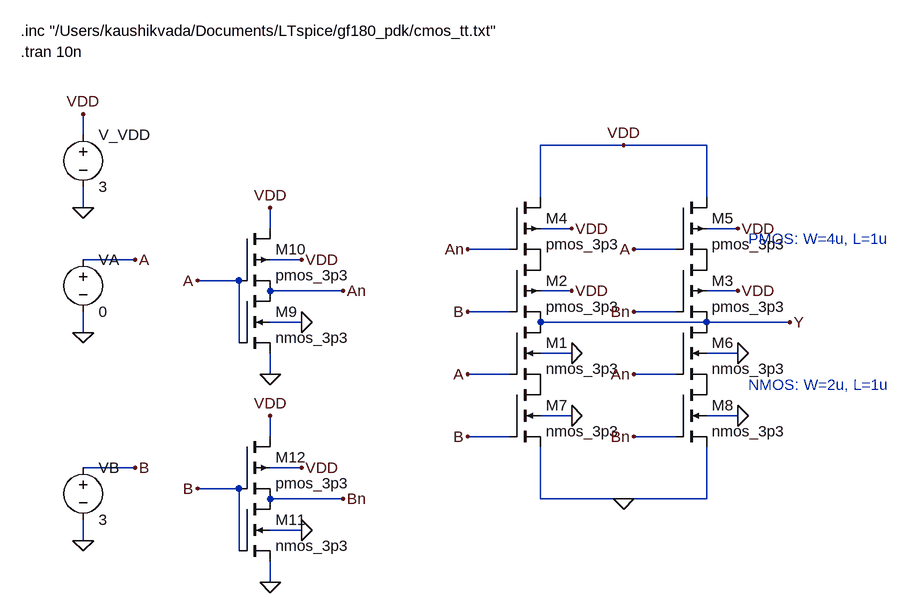
[diagram p0: schematic Q2_2_copy.asc]
Q2_2_copy.asc, the LTspice schematic file:
Version 4
SHEET 1 1600 900
WIRE 112 112 112 80
WIRE 944 128 816 128
WIRE 1072 128 944 128
WIRE 816 208 816 128
WIRE 1072 208 1072 128
WIRE 112 224 112 192
WIRE 400 256 400 224
WIRE 864 256 816 256
WIRE 1120 256 1072 256
WIRE 768 288 704 288
WIRE 1024 288 960 288
WIRE 192 304 112 304
WIRE 448 304 400 304
WIRE 352 336 288 336
WIRE 512 352 400 352
WIRE 864 352 816 352
WIRE 1120 352 1072 352
WIRE 768 384 704 384
WIRE 1024 384 960 384
WIRE 448 400 400 400
WIRE 1072 400 816 400
WIRE 1200 400 1072 400
WIRE 112 416 112 384
WIRE 352 432 352 336
WIRE 864 448 816 448
WIRE 1120 448 1072 448
WIRE 400 480 400 448
WIRE 768 480 704 480
WIRE 1024 480 960 480
WIRE 864 544 816 544
WIRE 1120 544 1072 544
WIRE 400 576 400 544
WIRE 768 576 704 576
WIRE 1024 576 960 576
WIRE 192 624 112 624
WIRE 448 624 400 624
WIRE 352 656 288 656
WIRE 512 672 400 672
WIRE 816 672 816 592
WIRE 944 672 816 672
WIRE 1072 672 1072 592
WIRE 1072 672 944 672
WIRE 448 720 400 720
WIRE 112 736 112 704
WIRE 352 752 352 656
WIRE 400 800 400 768
FLAG 112 80 VDD
FLAG 112 224 0
FLAG 192 304 A
FLAG 112 416 0
FLAG 192 624 B
FLAG 112 736 0
FLAG 400 224 VDD
FLAG 400 480 0
FLAG 288 336 A
FLAG 512 352 An
FLAG 448 304 VDD
FLAG 448 400 0
FLAG 400 544 VDD
FLAG 400 800 0
FLAG 288 656 B
FLAG 512 672 Bn
FLAG 448 624 VDD
FLAG 448 720 0
FLAG 944 128 VDD
FLAG 944 672 0
FLAG 1200 400 Y
FLAG 704 288 An
FLAG 960 288 A
FLAG 704 384 B
FLAG 960 384 Bn
FLAG 704 480 A
FLAG 960 480 An
FLAG 704 576 B
FLAG 960 576 Bn
FLAG 864 256 VDD
FLAG 1120 256 VDD
FLAG 864 352 VDD
FLAG 1120 352 VDD
FLAG 864 448 0
FLAG 1120 448 0
FLAG 864 544 0
FLAG 1120 544 0
SYMBOL voltage 112 96 R0
SYMATTR InstName V_VDD
SYMATTR Value 3
SYMBOL voltage 112 288 R0
SYMATTR InstName VA
SYMATTR Value 0
SYMBOL voltage 112 608 R0
SYMATTR InstName VB
SYMATTR Value 3
SYMBOL pmos4 352 256 R0
SYMATTR InstName M10
SYMATTR Value pmos_3p3
SYMBOL nmos4 352 352 R0
SYMATTR InstName M9
SYMATTR Value nmos_3p3
SYMBOL pmos4 352 576 R0
SYMATTR InstName M12
SYMATTR Value pmos_3p3
SYMBOL nmos4 352 672 R0
SYMATTR InstName M11
SYMATTR Value nmos_3p3
SYMBOL pmos4 768 208 R0
SYMATTR InstName M4
SYMATTR Value pmos_3p3
SYMATTR SpiceLine W=4u L=1u
SYMBOL pmos4 1024 208 R0
SYMATTR InstName M5
SYMATTR Value pmos_3p3
SYMATTR SpiceLine W=4u L=1u
SYMBOL pmos4 768 304 R0
SYMATTR InstName M2
SYMATTR Value pmos_3p3
SYMATTR SpiceLine W=4u L=1u
SYMBOL pmos4 1024 304 R0
SYMATTR InstName M3
SYMATTR Value pmos_3p3
SYMATTR SpiceLine W=4u L=1u
SYMBOL nmos4 768 400 R0
SYMATTR InstName M1
SYMATTR Value nmos_3p3
SYMATTR SpiceLine W=2u L=1u
SYMBOL nmos4 1024 400 R0
SYMATTR InstName M6
SYMATTR Value nmos_3p3
SYMATTR SpiceLine W=2u L=1u
SYMBOL nmos4 768 496 R0
SYMATTR InstName M7
SYMATTR Value nmos_3p3
SYMATTR SpiceLine W=2u L=1u
SYMBOL nmos4 1024 496 R0
SYMATTR InstName M8
SYMATTR Value nmos_3p3
SYMATTR SpiceLine W=2u L=1u
TEXT 16 -48 Left 2 !.inc "/Users/kaushikvada/Documents/LTspice/gf180_pdk/cmos_tt.txt"
TEXT 16 -16 Left 2 !.tran 10n
TEXT 1136 272 Left 2 ;PMOS: W=4u, L=1u
TEXT 1136 496 Left 2 ;NMOS: W=2u, L=1u

The netlist it stands for:
* Q2_2_copy.asc
V_VDD VDD 0 3
VA A 0 0
VB B 0 3
M10 VDD A An VDD pmos_3p3
M9 An A 0 0 nmos_3p3
M12 VDD B Bn VDD pmos_3p3
M11 Bn B 0 0 nmos_3p3
M4 VDD An P001 VDD pmos_3p3 W=4u L=1u
M5 VDD A P002 VDD pmos_3p3 W=4u L=1u
M2 P001 B Y VDD pmos_3p3 W=4u L=1u
M3 P002 Bn Y VDD pmos_3p3 W=4u L=1u
M1 Y A P003 0 nmos_3p3 W=2u L=1u
M6 Y An P004 0 nmos_3p3 W=2u L=1u
M7 P003 B 0 0 nmos_3p3 W=2u L=1u
M8 P004 Bn 0 0 nmos_3p3 W=2u L=1u
.model NMOS NMOS
.model PMOS PMOS
.lib standard.mos
.inc "/Users/kaushikvada/Documents/LTspice/gf180_pdk/cmos_tt.txt"
.tran 10n
* PMOS: W=4u, L=1u
* NMOS: W=2u, L=1u
.backanno
.end